# EAGLE design A4a WiFi LoRa 32 (EAGLE 9.6.1)
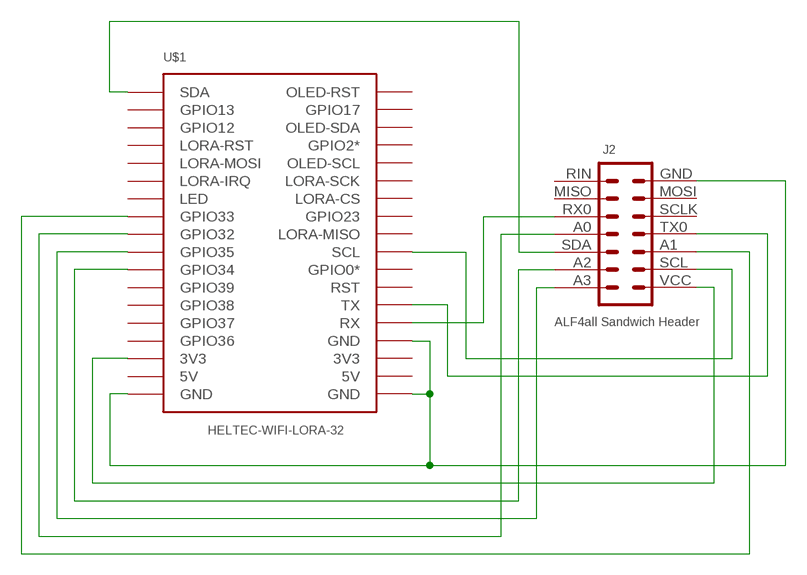
[diagram p0: schematic, sheet 1]

## Parts
J2  ALF4all Sandwich Header  HEADER-2X7-ALF4ALL-PROCESSOR-B  [CONN_2X7-ALF4ALL-PROCESSOR-B]
U$1  HELTEC-WIFI-LORA-32  [HELTEC-WIFI-LORA-32]

## Nets
GND: J2.GND U$1.GND@1(GND) U$1.GND@4(GND) U$1.GND@36(GND)
N$1: J2.TX0 U$1.TX
N$2: J2.SDA U$1.GPIO21(SDA)
N$3: J2.SCL U$1.GPIO22(SCL)
N$7: J2.A0 U$1.GPIO32
N$8: J2.A2 U$1.GPIO34
N$9: J2.A3 U$1.GPIO35
N$11: J2.A1 U$1.GPIO33
N$12: J2.RX0 U$1.RX
VCC: J2.VCC U$1.3V3@34(3V3)
Unconnected: J2.MISO J2.MOSI J2.RIN J2.SCLK U$1.3V3@3(3V3) U$1.5V@2(5V) U$1.5V@35(5V) U$1.GPIO0(GPIO0*) U$1.GPIO2(GPIO2*) U$1.GPIO4(OLED-SDA) U$1.GPIO5(LORA-SCK) U$1.GPIO12 U$1.GPIO13 U$1.GPIO14(LORA-RST) U$1.GPIO15(OLED-SCL) U$1.GPIO16(OLED-RST) U$1.GPIO17 U$1.GPIO18(LORA-CS) U$1.GPIO19(LORA-MISO) U$1.GPIO23 U$1.GPIO25(LED) U$1.GPIO26(LORA-IRQ) U$1.GPIO27(LORA-MOSI) U$1.GPIO36 U$1.GPIO37 U$1.GPIO38 U$1.GPIO39 U$1.RST

## Library data of the parts
J2 = digitalconcepts:HEADER-2X7-ALF4ALL-PROCESSOR-B: ALF4all 'Sandwixh' Processor (Bottom) 2x7 Pin Header and earthed 1x1 locator pins for ALF4all 'Sandwich' Processor/RFM95W PCBs Header soldered to underside of PCB
U$1 = digitalconcepts:HELTEC-WIFI-LORA-32: Heltec WiFi LoRa 32 Development Board

## Board
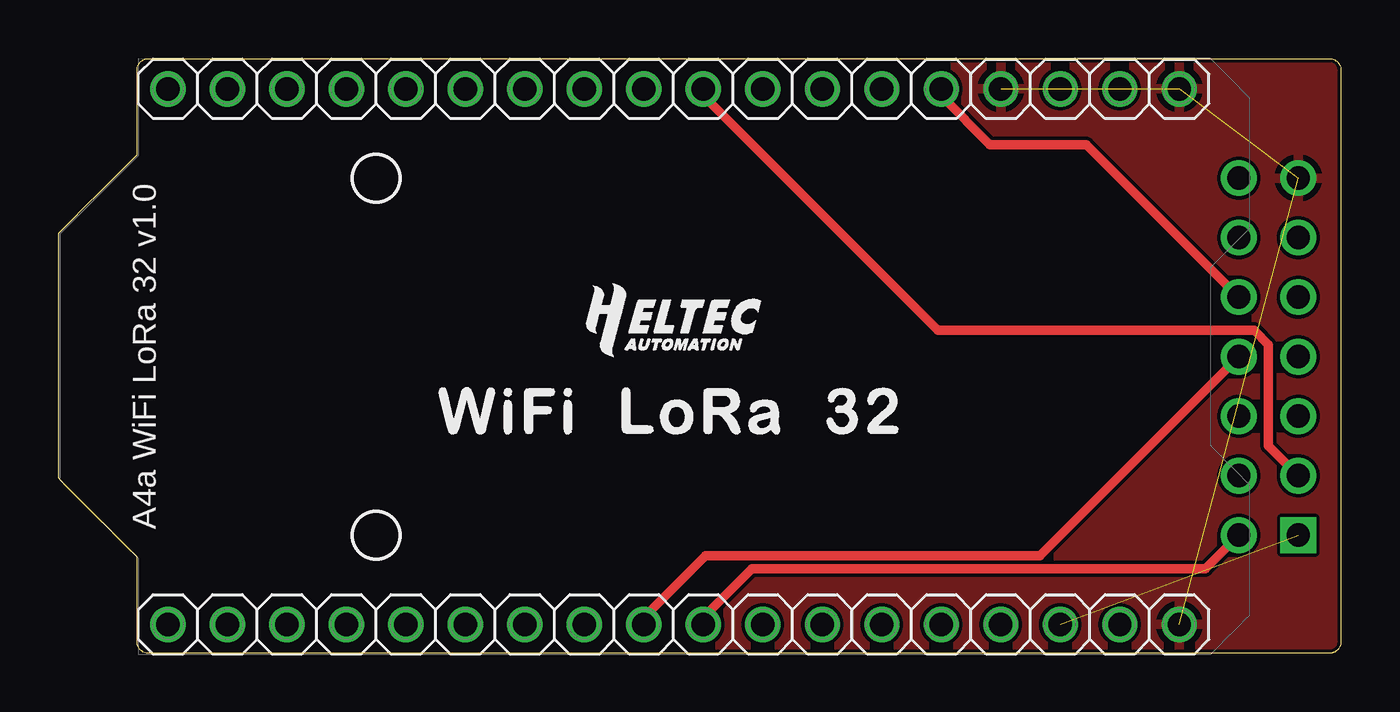
[diagram p1: board, top side]
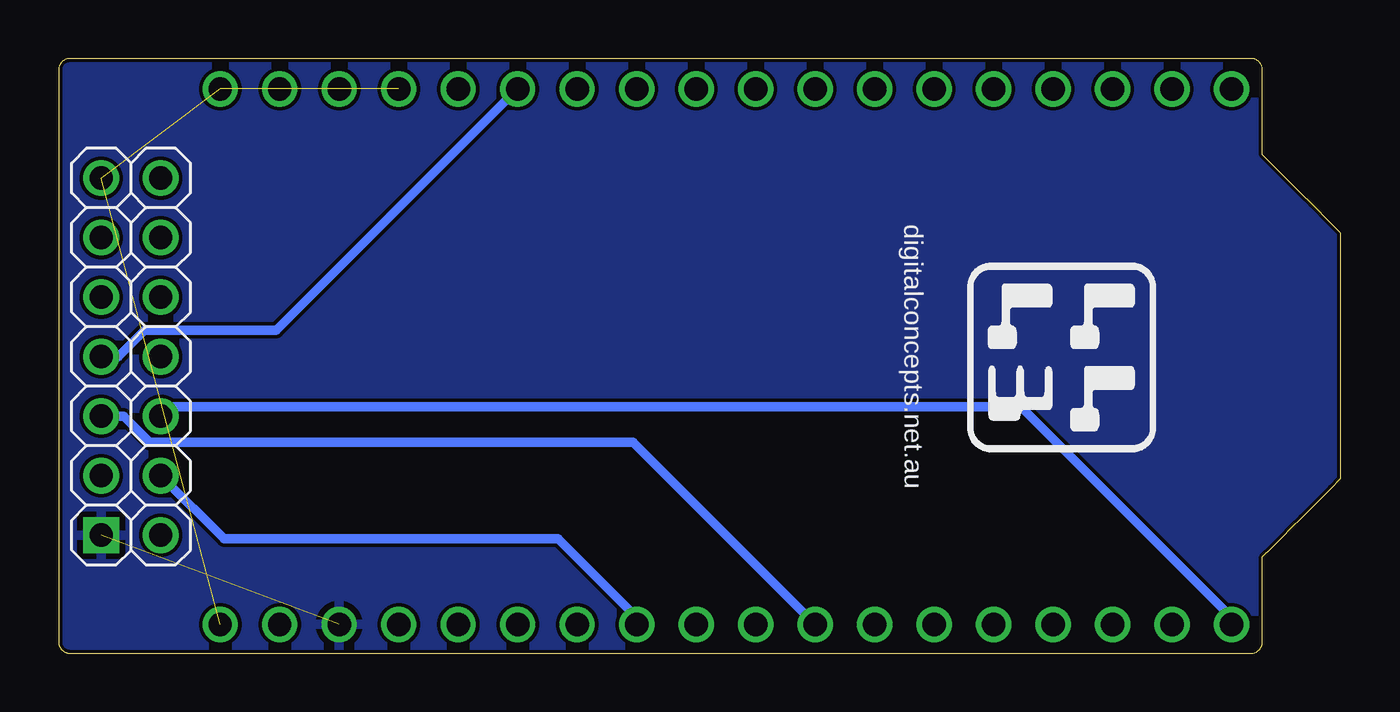
[diagram p2: board, bottom side, seen from below]

Size 54.76 x 25.38 mm. Coordinates in mm from the lower left corner, seen from the top.
Outline: 3.35,21.27 2.93,20.85 2.51,20.43 2.09,20.01 1.67,19.6 1.26,19.18 0.42,18.34 0,17.92 0,7.46 0.42,7.04 0.84,6.63 1.26,6.21 1.67,5.79 2.09,5.37 2.51,4.95 2.93,4.53 3.35,4.11
Outline: 3.35,21.27 3.35,21.27
Outline: 3.35,21.27 3.35,22.85 3.35,23.08 3.35,24.92 3.35,24.95 3.37,25.02 3.38,25.05 3.39,25.08 3.4,25.11 3.42,25.14 3.43,25.16 3.45,25.19 3.47,25.21 3.49,25.24 3.52,25.26 3.54,25.28 3.57,25.3 3.59,25.32 3.62,25.33 3.65,25.34 3.68,25.36 3.71,25.37 3.74,25.37 3.77,25.38 3.81,25.38 54.3,25.38 54.33,25.38 54.36,25.37 54.4,25.37 54.43,25.36 54.46,25.34 54.48,25.33 54.51,25.32 54.54,25.3 54.56,25.28 54.59,25.26 54.61,25.24 54.63,25.21 54.65,25.19 54.67,25.16 54.69,25.14 54.7,25.11 54.72,25.08 54.73,25.05 54.74,25.02 54.75,24.98 54.75,24.95 54.76,24.92 54.76,0.47 54.75,0.43 54.75,0.4 54.74,0.37 54.73,0.34 54.72,0.31 54.7,0.28 54.69,0.25 54.67,0.22 54.65,0.19 54.63,0.17 54.61,0.15 54.59,0.12 54.56,0.1 54.54,0.09 54.51,0.07 54.48,0.05 54.46,0.04 54.43,0.03 54.4,0.02 54.36,0.01 54.33,0 54.3,0 3.81,0 3.77,0 3.74,0.01 3.71,0.02 3.68,0.03 3.62,0.05 3.59,0.07 3.57,0.09 3.54,0.1 3.52,0.12 3.49,0.15 3.47,0.17 3.45,0.19 3.43,0.22 3.42,0.25 3.4,0.28 3.39,0.31 3.38,0.34 3.37,0.37 3.36,0.4 3.35,0.43 3.35,0.47 3.35,0.5
Outline: 3.35,0.5 3.35,0.5
Outline: 3.35,0.5 3.35,0.9 3.35,1.06 3.35,3.55 3.35,3.72 3.35,4.11
Outline: 3.35,4.11 3.35,4.11
Copper layers (1*16): Top 0.035mm / dielectric 1.5mm / Bottom 0.035mm
Design rules "default *": minimum track width 6mil, minimum drill 0.35mm, track to track 6mil, track to pad 6mil, pad to pad 6mil, via to via 6mil, smd to smd 6mil, copper to edge 6mil, drill to drill 6mil, minimum pad ring 10mil, minimum via ring 8mil, stop-mask expansion 4mil, vias tented up to drill 0mil, thermal gap 10mil

### Footprints (pad centres in the part's own frame; a part is rotated, then mirrored left to right if it is on the bottom)
CONN_2X7-ALF4ALL-PROCESSOR-B = drill 1 pad 1.524: A0 7.62,2.54; A1 5.08,0; A2 2.54,2.54; A3 0,2.54; GND 15.24,0; MISO 12.7,2.54; MOSI 12.7,0; RIN 15.24,2.54; RX0 10.16,2.54; SCL 2.54,0; SCLK 10.16,0; SDA 5.08,2.54; TX0 7.62,0 | drill 1 pad 1.524 square: VCC 0,0
HELTEC-WIFI-LORA-32 = drill 1: 3V3@3 0,5.08; 3V3@34 -22.86,5.08; 5V@2 0,2.54; 5V@35 -22.86,2.54; GND@1 0,0; GND@4 0,7.62; GND@36 -22.86,0; GPIO0 0,17.78; GPIO2 0,35.56; GPIO4 0,38.1; GPIO5 0,33.02; GPIO12 -22.86,38.1; GPIO13 -22.86,40.64; GPIO14 -22.86,35.56; GPIO15 0,30.48; GPIO16 0,43.18; GPIO17 0,40.64; GPIO18 0,27.94; GPIO19 0,22.86; GPIO21 -22.86,43.18; GPIO22 0,20.32; GPIO23 0,25.4; GPIO25 -22.86,27.94; GPIO26 -22.86,30.48; GPIO27 -22.86,33.02; GPIO32 -22.86,22.86; GPIO33 -22.86,25.4; GPIO34 -22.86,17.78; GPIO35 -22.86,20.32; GPIO36 -22.86,7.62; GPIO37 -22.86,10.16; GPIO38 -22.86,12.7; GPIO39 -22.86,15.24; RST 0,15.24; RX 0,10.16; TX 0,12.7

### Placement (x,y rotation side)
J2  52.93,5.04 90 top
U$1  47.85,24.09 90 top

### Tracks (layer width: path | path; a pad name or v marks a point on that pad's centre or on a via)
GND  (3 unrouted)
  pour Top: -1.68,26.63 56.74,26.63 56.74,-1.31 -1.68,-1.31
N$1
  Bottom 0.406: J2.TX0 52.2,12.66 51.09,13.78 45.47,13.78 U$1.TX
N$2
  Bottom 0.406: J2.SDA 50,10.52 13.66,10.52 4.67,1.53 U$1.GPIO21
N$3
  Top 0.406: J2.SCL 51.66,8.85 51.66,13.17 51.06,13.78 37.55,13.78 27.53,23.79 U$1.GPIO22
N$7
  Top 0.406: J2.A0 41.9,4.17 27.63,4.17 24.99,1.53 U$1.GPIO32
N$8
  Bottom 0.406: J2.A2 47.69,4.88 33.42,4.88 30.07,1.53 U$1.GPIO34
N$9
  Top 0.406: J2.A3 48.96,3.61 29.61,3.61 27.53,1.53 U$1.GPIO35
N$11
  Bottom 0.406: J2.A1 51.97,10.12 50.86,9 30.23,9 U$1.GPIO33
N$12
  Top 0.406: J2.RX0 43.88,21.71 39.77,21.71 37.69,23.79 U$1.RX
VCC  (1 unrouted)
  pour Bottom: 55.47,25.36 -0.41,25.36 -0.41,-0.04 55.47,-0.04

### Text on the board
tPlace: A4a WiFi LoRa 32 v1.0
bPlace: digitalconcepts.net.au